# Altium schematic sheet Power.SchDoc
size B; DocumentNumber: 4; SheetNumber: 3; SheetTotal: 4
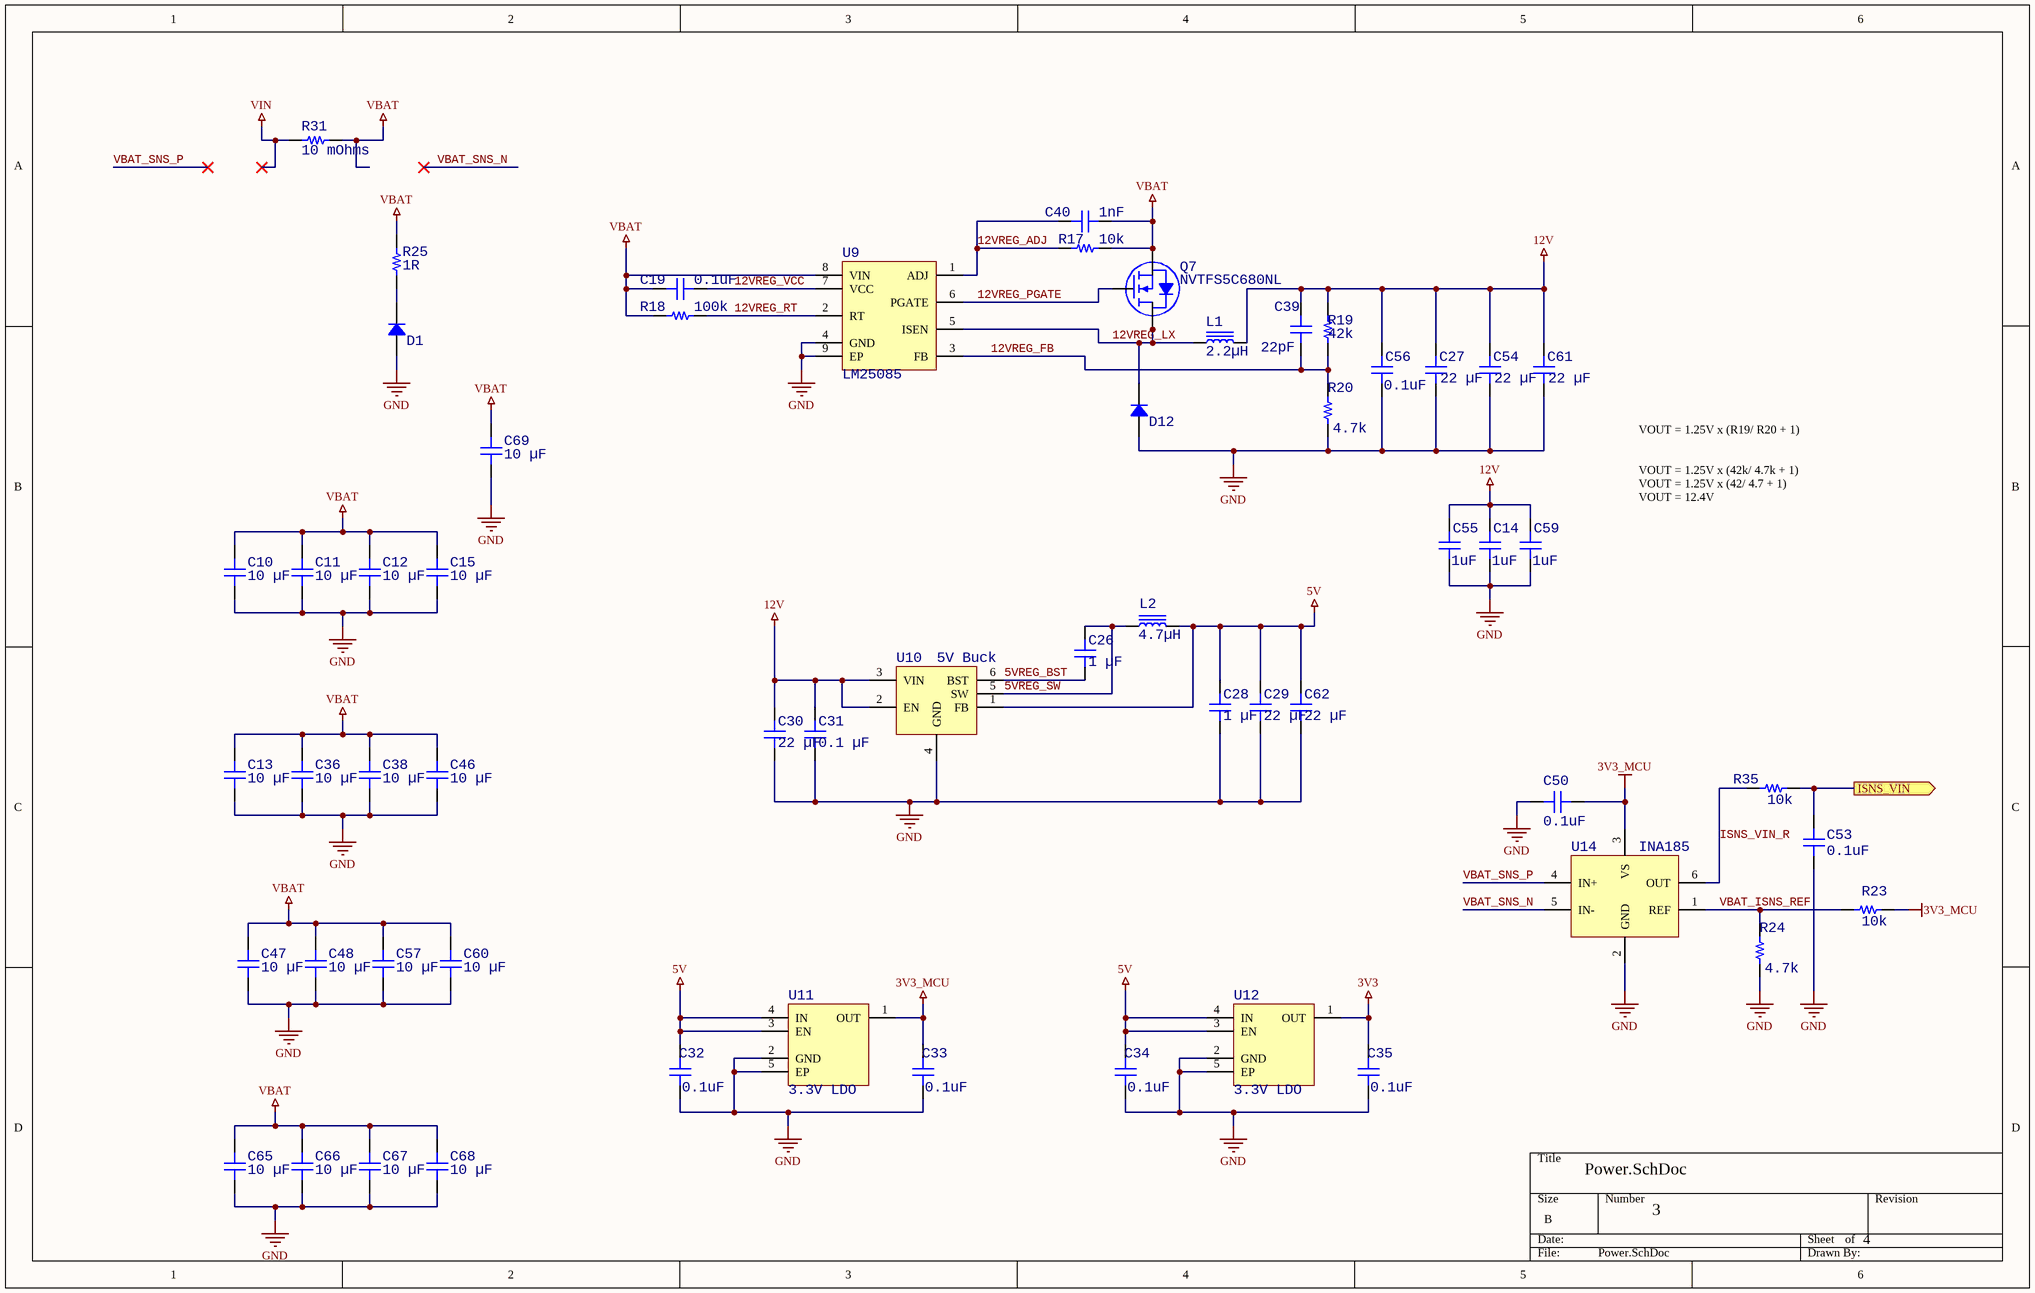
[diagram p0: Power.SchDoc]

## Parts
C10  10 µF  [CAP 1206_3216 - 0.8MM]
C11  10 µF  [CAP 1206_3216 - 0.8MM]
C12  10 µF  [CAP 1206_3216 - 0.8MM]
C13  10 µF  [CAP 1206_3216 - 0.8MM]
C14  1uF  [CAP_0402]
C15  10 µF  [CAP 1206_3216 - 0.8MM]
C19  0.1uF  [CAP_0402]
C26  1 µF  [CAP 0402_1005]
C27  22 µF  [CAP 0805_2012]
C28  1 µF  [CAP 0402_1005]
C29  22 µF  [CAP 0603_1608]
C30  22 µF  [CAP 0603_1608]
C31  0.1 µF  [CAP 0402_1005]
C32  0.1uF  [CAP_0402]
C33  0.1uF  [CAP_0402]
C34  0.1uF  [CAP_0402]
C35  0.1uF  [CAP_0402]
C36  10 µF  [CAP 1206_3216 - 0.8MM]
C38  10 µF  [CAP 1206_3216 - 0.8MM]
C39  22pF  [CAP_0402]
C40  1nF  [CAP_0402]
C46  10 µF  [CAP 1206_3216 - 0.8MM]
C47  10 µF  [CAP 1206_3216 - 0.8MM]
C48  10 µF  [CAP 1206_3216 - 0.8MM]
C50  0.1uF  [CAP_0402]
C53  0.1uF  [CAP_0402]
C54  22 µF  [CAP 0805_2012]
C55  1uF  [CAP_0402]
C56  0.1uF  [CAP_0402]
C57  10 µF  [CAP 1206_3216 - 0.8MM]
C59  1uF  [CAP_0402]
C60  10 µF  [CAP 1206_3216 - 0.8MM]
C61  22 µF  [CAP 0805_2012]
C62  22 µF  [CAP 0603_1608]
C65  10 µF  [CAP 1206_3216 - 0.8MM]
C66  10 µF  [CAP 1206_3216 - 0.8MM]
C67  10 µF  [CAP 1206_3216 - 0.8MM]
C68  10 µF  [CAP 1206_3216 - 0.8MM]
C69  10 µF  [CAP 1206_3216 - 0.8MM]
D1  SE10FGHM3/H  [SMF DO-219AB]  (value not drawn)
D12  SE10FGHM3/H  [SMF DO-219AB]  (value not drawn)
L1  2.2µH  [IND 1008_2520]
L2  4.7µH  [IND 1008_2520]
Q7  NVTFS5C680NL  [NVTFS015N04CTAG]
R17  10k  [RES_0402]
R18  100k  [RES_0402]
R19  42k  [RES_0402]
R20  4.7k  [RES_0402]
R23  10k  [RES_0402]
R24  4.7k  [RES_0402]
R25  1R  [RES 0603_1608]
R31  10 mOhms  [RES 1206_3216]
R35  10k  [RES_0402]
U9  LM25085  [8_WSON_3x3_0.5mm]
U10  5V Buck  [TSOT-26-6 - 3.2mm]
U11  3.3V LDO  [XDFN-4]
U12  3.3V LDO  [XDFN-4]
U14  INA185  [TI SC70-6 DCK]

## Ports
ISNS_VIN (out)

## Nets
3V3: C35.2 U12.1(OUT)
3V3_MCU: C33.2 C50.1 R23.1 U11.1(OUT) U14.3(VS)
5V: C28.2 C29.2 C32.2 C34.2 C62.2 L2.2 U10.1(FB) U11.3(EN) U11.4(IN) U12.3(EN) U12.4(IN)
12V: C14.2 C27.2 C30.2 C31.2 C39.2 C54.2 C55.2 C56.2 C59.2 C61.2 L1.2 R19.1 U10.2(EN) U10.3(VIN)
GND: C10.1 C11.1 C12.1 C13.1 C14.1 C15.1 C27.1 C28.1 C29.1 C30.1 C31.1 C32.1 C33.1 C34.1 C35.1 C36.1 C38.1 C46.1 C47.1 C48.1 C50.2 C53.2 C54.1 C55.1 C56.1 C57.1 C59.1 C60.1 C61.1 C62.1 C65.1 C66.1 C67.1 C68.1 C69.1 D1.1 D12.1 R20.2 R24.2 U9.4(GND) U9.9(EP) U10.4(GND) U11.2(GND) U11.5(EP) U12.2(GND) U12.5(EP) U14.2(GND)
VBAT: C10.2 C11.2 C12.2 C13.2 C15.2 C19.1 C36.2 C38.2 C40.2 C46.2 C47.2 C48.2 C57.2 C60.2 C65.2 C66.2 C67.2 C68.2 C69.2 Q7.1(S) Q7.2(S) Q7.3(S) R17.1 R18.2 R25.2 R31.2 U9.8(VIN)
VIN: R31.1
5VREG_BST: C26.1 U10.6(BST)
5VREG_SW: C26.2 L2.1 U10.5(SW)
12VREG_ADJ: C40.1 R17.2 U9.1(ADJ)
12VREG_FB: C39.1 R19.2 R20.1 U9.3(FB)
12VREG_LX: D12.2 L1.1 Q7.5(D) Q7.6(D) Q7.7(D) Q7.8(D) U9.5(ISEN)
12VREG_PGATE: Q7.4(G) U9.6(PGATE)
12VREG_RT: R18.1 U9.2(RT)
12VREG_VCC: C19.2 U9.7(VCC)
ISNS_VIN: C53.1 R35.1 ; port ISNS_VIN
ISNS_VIN_R: R35.2 U14.6(OUT)
VBAT_ISNS_REF: R23.2 R24.1 U14.1(REF)
VBAT_SNS_N: U14.5(IN-)
VBAT_SNS_P: U14.4(IN+)
NetD1_2: D1.2 R25.1

## Notes on the sheet
- VOUT = 1.25V x (R19/ R20 + 1)
- VOUT = 1.25V x (42k/ 4.7k + 1)
  VOUT = 1.25V x (42/ 4.7 + 1)
  VOUT = 12.4V

## Library data of the parts
C10-C13 C15 C36 C38 C46-C48 C57 C60 C65-C69 = CL31X106KAHNNNE: CAP CER 10UF 25V X6S 1206; manufacturer: Samsung Electro-Mechanics; Tolerance: ±10%; Part Number: CL31X106KAHNNNE; Value: 10 µF; Applications: General Purpose; Capacitance: 10 µF; componentlink1description: Datasheet; componentlink1url: http://www.samsungsem.com/kr/support/product-search/mlcc/CL31X106KAHNNNE.jsp; componentlink2description: DigiKey Link; componentlink2url: https://www.digikey.com/en/products/detail/samsung-electro-mechanics/CL31X106KAHNNNE/3888956; Device Package: 1206 (3216 Metric); lastupdated: 6/4/2024 7:10:40 PM; Lifecycle Status: Active; Minimum Order: 1; Mounting Type: Surface Mount, MLCC; Operating Temperature: -55°C ~ 105°C; Package / Case: 1206 (3216 Metric); packaging: TapeAndReel; partid: 20108; Part Status: Active; price: 0.05; series: CL; Size / Dimension: 0.126" L x 0.063" W (3.20mm x 1.60mm); Supplier 1: DigiKey; Supplier Part Number 1: 1276-3298-1-ND; Temperature Coefficient: X6S; Thickness (Max): 0.071" (1.80mm); Voltage - Rated: 25V
C14 C19 C32-C35 C39 C40 C50 C53 C55 C56 C59 = CAP_0402: CAP CER 402
  C14 C55 C59: Value: 1uF
  C19 C32-C35 C50 C53 C56: Value: 0.1uF
  C39: Value: 22pF
  C40: Value: 1nF
C26 C28 = C0402C104K4RACAUTO: CAP CER 0.1UF 16V X7R 0402; manufacturer: KEMET; Capacitance: 0.1 µF; Tolerance: ±10%; Part Number: C0402C104K4RACAUTO; Value: 1 µF; Applications: Automotive, Bypass, Decoupling; componentlink1description: Datasheet; componentlink1url: https://api.kemet.com/component-edge/download/specsheet/C0402C104K4RACAUTO.pdf; componentlink2description: DigiKey Link; componentlink2url: https://www.digikey.com/en/products/detail/kemet/C0402C104K4RACAUTO/3314827; Device Package: 0402 (1005 Metric); lastupdated: 2/9/2024 8:04:35 PM; Lifecycle Status: Active; Minimum Order: 1; Mounting Type: Surface Mount, MLCC; Operating Temperature: -55°C ~ 125°C; Package / Case: 0402 (1005 Metric); packaging: TapeAndReel; partid: 3024; Part Status: Active; price: 0.01; Ratings: AEC-Q200; series: SMD Auto X7R; Size / Dimension: 0.039" L x 0.020" W (1.00mm x 0.50mm); Supplier 1: DigiKey; Supplier Part Number 1: 399-6828-1-ND; Temperature Coefficient: X7R; Thickness (Max): 0.022" (0.55mm); Voltage - Rated: 16V
C27 C54 C61 = KGM21AS61C226MU: CAP CER 22UF 16V X6S 0805; manufacturer: KYOCERA AVX; Tolerance: ±20%; Part Number: KGM21AS61C226MU; Value: 22 µF; Applications: General Purpose; Capacitance: 22 µF; componentlink1description: Datasheet; componentlink1url: https://media.digikey.com/pdf/Data%20Sheets/AVX%20PDFs/CM03_CM05_CM105_CM21_CM316_Spec.pdf; componentlink2description: DigiKey Link; componentlink2url: https://www.digikey.com/en/products/detail/kyocera-avx/KGM21AS61C226MU/17827473; Device Package: 0805 (2012 Metric); lastupdated: 2/9/2024 8:14:12 PM; Lifecycle Status: Active; Minimum Order: 1; Mounting Type: Surface Mount, MLCC; Operating Temperature: -55°C ~ 105°C; Package / Case: 0805 (2012 Metric); packaging: TapeAndReel; partid: 52516; Part Status: Active; price: 0.12; series: KGM - X6S; Size / Dimension: 0.079" L x 0.049" W (2.01mm x 1.25mm); Supplier 1: DigiKey; Supplier Part Number 1: 478-KGM21AS61C226MUCT-ND; Temperature Coefficient: X6S; Thickness (Max): 0.057" (1.45mm); Voltage - Rated: 16V
C29 C30 C62 = C0603B476M007T: CAP CER 47UF 6.3V X5R 0603; manufacturer: Holy Stone Enterprise Co., Ltd.; Capacitance: 47 µF; Tolerance: ±20%; Part Number: C0603B476M007T; Value: 22 µF; Applications: SMPS Filtering; componentlink1description: Datasheet; componentlink1url: https://media.digikey.com/pdf/Data%20Sheets/Holy%20Stone/HCC_Series_DS.pdf; componentlink2description: DigiKey Link; componentlink2url: https://www.digikey.com/en/products/detail/holy-stone-enterprise-co-ltd/C0603B476M007T/16895203; Device Package: 0603 (1608 Metric); lastupdated: 2/9/2024 8:09:41 PM; Lifecycle Status: Active; Minimum Order: 1; Mounting Type: Surface Mount, MLCC; Operating Temperature: -55°C ~ 85°C; Package / Case: 0603 (1608 Metric); packaging: TapeAndReel; partid: 48531; Part Status: Active; price: 0.12; series: HCC; Size / Dimension: 0.063" L x 0.031" W (1.60mm x 0.80mm); Supplier 1: DigiKey; Supplier Part Number 1: 4587-C0603B476M007TCT-ND; Temperature Coefficient: X5R; Thickness (Max): 0.039" (1.00mm); Voltage - Rated: 6.3V
C31 = C0402C104K4RACAUTO: CAP CER 0.1UF 16V X7R 0402; manufacturer: KEMET; Tolerance: ±10%; Part Number: C0402C104K4RACAUTO; Value: 0.1 µF; Applications: Automotive, Bypass, Decoupling; Capacitance: 0.1 µF; componentlink1description: Datasheet; componentlink1url: https://api.kemet.com/component-edge/download/specsheet/C0402C104K4RACAUTO.pdf; componentlink2description: DigiKey Link; componentlink2url: https://www.digikey.com/en/products/detail/kemet/C0402C104K4RACAUTO/3314827; Device Package: 0402 (1005 Metric); lastupdated: 2/9/2024 8:04:35 PM; Lifecycle Status: Active; Minimum Order: 1; Mounting Type: Surface Mount, MLCC; Operating Temperature: -55°C ~ 125°C; Package / Case: 0402 (1005 Metric); packaging: TapeAndReel; partid: 3024; Part Status: Active; price: 0.01; Ratings: AEC-Q200; series: SMD Auto X7R; Size / Dimension: 0.039" L x 0.020" W (1.00mm x 0.50mm); Supplier 1: DigiKey; Supplier Part Number 1: 399-6828-1-ND; Temperature Coefficient: X7R; Thickness (Max): 0.022" (0.55mm); Voltage - Rated: 16V
D1 D12 = SE10FGHM3/H: DIODE GEN PURP 400V 1A DO219AB; Manufacturer: Vishay Semiconductor Diodes Division; Capacitance @ Vr, F: 7.5pF @ 4V, 1MHz; Current - Reverse Leakage @ Vr: 5µA @ 400V; Diode Type: Standard; Reverse Recovery Time (trr): 780ns; Speed: Standard Recovery >500ns, > 200mA (Io); Voltage - Forward (Vf) (Max) @ If: 1.05V @ 1A; Part Number: SE10FGHM3/H; ComponentLink1Description: Datasheet; ComponentLink1URL: http://www.vishay.com/docs/87722/se10fd-se10fg-se10fj.pdf; ComponentLink2Description: DigiKey Link; ComponentLink2URL: http://digikey.com/product-detail/en/vishay-semiconductor-diodes-division/SE10FGHM3-H/SE10FGHM3-HGICT-ND/8565217; Current - Average Rectified (Io): 1A; LastUpdated: 6/3/2024 8:05:29 PM; Lifecycle Status: Active; Minimum Order: 1; Mounting Type: Surface Mount; Operating Temperature - Junction: -55°C ~ 175°C; Package / Case: DO-219AB; Packaging: TapeAndReel; PartId: 1227; Part Status: Active; Price: 0.10; Series: Automotive, AEC-Q101; Supplier 1: DigiKey; Supplier Part Number 1: SE10FGHM3/HGICT-ND; Supplier Device Package: DO-219AB (SMF); Voltage - DC Reverse (Vr) (Max): 400V
L1 = AIML-1008HC-2R2M-T: FIXED IND 2.2UH 1.5A 90 MOHM SMD; Manufacturer: Abracon LLC; DC Resistance (DCR): 90mOhm; Frequency - Self Resonant: 40MHz; Inductance Frequency - Test: 1MHz; Material - Core: Ferrite; Shielding: Shielded; Tolerance: ±20%; Type: Multilayer; Part Number: AIML-1008HC-2R2M-T; ComponentLink1Description: Datasheet; ComponentLink1URL: https://abracon.com/Magnetics/inductors/AIML-1008HC.pdf; ComponentLink2Description: DigiKey Link; ComponentLink2URL: http://digikey.com/product-detail/en/abracon-llc/AIML-1008HC-2R2M-T/535-12795-1-ND/5043541; Current Rating (Amps): 1.5A; Device Package: 1008 (2520 Metric); Height - Seated (Max): 0.039" (1.00mm); Inductance: 2.2µH; LastUpdated: 9/2/2020 1:29:58 AM; Lifecycle Status: Active; Minimum Order: 1; Mounting Type: Surface Mount; Operating Temperature: -55°C ~ 125°C; Package / Case: 1008 (2520 Metric); Packaging: TapeAndReel; PartId: 3534; Part Status: Active; Price: 0.12; Series: AIML-1008HC; Size / Dimension: 0.098" L x 0.079" W (2.50mm x 2.00mm); Supplier 1: DigiKey; Supplier Part Number 1: 535-12795-1-ND; Supplier Device Package: 1008 (2520 Metric); Value: 2.2µH
L2 = MLP2520S4R7ST0S1: FIXED IND 4.7UH 1A 110 MOHM SMD; Manufacturer: TDK Corporation; DC Resistance (DCR): 143mOhm Max; Inductance Frequency - Test: 2MHz; Material - Core: Ferrite; Shielding: Shielded; Tolerance: ±20%; Type: Multilayer; Part Number: MLP2520S4R7ST0S1; ComponentLink1Description: Datasheet; ComponentLink1URL: https://product.tdk.com/info/en/catalog/datasheets/inductor_commercial_power_mlp2520_en.pdf?ref_disty=digikey; ComponentLink2Description: DigiKey Link; ComponentLink2URL: http://digikey.com/product-detail/en/tdk-corporation/MLP2520S4R7ST0S1/445-6378-1-ND/2465705; Current Rating (Amps): 1A; Device Package: 1008 (2520 Metric); Height - Seated (Max): 0.039" (1.00mm); Inductance: 4.7µH; LastUpdated: 9/2/2020 1:29:23 AM; Lifecycle Status: Active; Minimum Order: 1; Mounting Type: Surface Mount; Operating Temperature: -40°C ~ 125°C; Package / Case: 1008 (2520 Metric); Packaging: TapeAndReel; PartId: 3467; Part Status: Active; Price: 0.14; Series: MLP; Size / Dimension: 0.098" L x 0.079" W (2.50mm x 2.00mm); Supplier 1: DigiKey; Supplier Part Number 1: 445-6378-1-ND; Supplier Device Package: 1008 (2520 Metric); Value: 4.7µH
Q7 = NVTFS5C680NL: N-FET
R17-R20 R23 R24 R35 = RES_0402: RES 0402
R25 = APC0603B1K00N: 1/16 WATTS PRECISION CHIP 1 KILO; Manufacturer: Ohmite; Power (Watts): 0.063W, 1/16W; Resistance: 1 kOhms; Temperature Coefficient: ±25ppm/°C; Tolerance: ±0.1%; Part Number: APC0603B1K00N; Value: 1R; ComponentLink1Description: Datasheet; ComponentLink1URL: https://www.ohmite.com/assets/docs/APC-1-15.34.pdf; ComponentLink2Description: DigiKey Link; ComponentLink2URL: https://www.digikey.com/en/products/detail/ohmite/APC0603B1K00N/16369506; Composition: Thin Film; Device Package: 0603 (1608 Metric); Height - Seated (Max): 0.022" (0.55mm); LastUpdated: 2/9/2024 8:40:40 PM; Lifecycle Status: Active; Minimum Order: 1; Number of Terminations: 2; Operating Temperature: -55°C ~ 155°C; Package / Case: 0603 (1608 Metric); Packaging: TapeAndReel; PartId: 78336; Part Status: Active; Price: 0.05; Series: APC; Size / Dimension: 0.061" L x 0.031" W (1.55mm x 0.80mm); Supplier 1: DigiKey; Supplier Part Number 1: 273-APC0603B1K00NCT-ND; Supplier Device Package: 0603
R31 = KRL1632E-M-R039-F-T5: RES 0.039 OHM 1% 3/4W 1206; Manufacturer: Susumu; Power (Watts): 0.75W, 3/4W; Resistance: 39 mOhms; Temperature Coefficient: ±50ppm/°C; Value: 39 mOhms; Part Number: KRL1632E-M-R039-F-T5; ComponentLink1Description: Datasheet; ComponentLink1URL: http://www.susumu.co.jp/common/pdf/n_catalog_partition09_en.pdf; ComponentLink2Description: DigiKey Link; ComponentLink2URL: https://www.digikey.com/en/products/detail/susumu/KRL1632E-M-R039-F-T5/3738003; Composition: Metal Foil; Device Package: 1206 (3216 Metric); Features: Automotive AEC-Q200, Current Sense; Height - Seated (Max): 0.028" (0.70mm); LastUpdated: 2/9/2024 8:54:46 PM; Lifecycle Status: Active; Minimum Order: 1; Number of Terminations: 2; Operating Temperature: -55°C ~ 155°C; Package / Case: 1206 (3216 Metric); Packaging: TapeAndReel; PartId: 26838; Part Status: Active; Price: 0.09; Ratings: AEC-Q200; Series: KRL; Size / Dimension: 0.126" L x 0.063" W (3.20mm x 1.60mm); Supplier 1: DigiKey; Supplier Part Number 1: 408-1577-1-ND; Supplier Device Package: 1206; Tolerance: ±1%
U9 = LM25085: PFET Buck Controller
U10 = AP63205WU-7: 5V fixed step down Buck
U11 U12 = TLV74033PDQNR
U14 = INA185: INA185A2